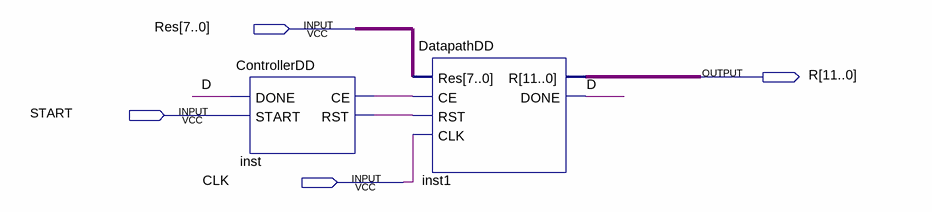
[diagram p0: schematic sheet]
// Quartus schematic DD.bdf as structural Verilog: 2 symbols, 4 pins
module DD (
  input  [7:0] Res,
  input  START,
  input  CLK,
  output [11:0] R
);

  wire D, inst_ce, inst_rst;

  ControllerDD inst (.DONE(D), .START(START), .CE(inst_ce), .RST(inst_rst));
  DatapathDD inst1 (.Res(Res), .CE(inst_ce), .RST(inst_rst), .CLK(CLK), .R(R), .DONE(D));
endmodule
